# Altium project MiniPC MB GOST.PrjPcb (part 5 of 31)

## Sheet Converter 12V-0V9.SchDoc
size 420 x 297 mm; Author: ALTIUM GOSTBOM2.0 KEV; SheetNumber: 33; SheetTotal: 48
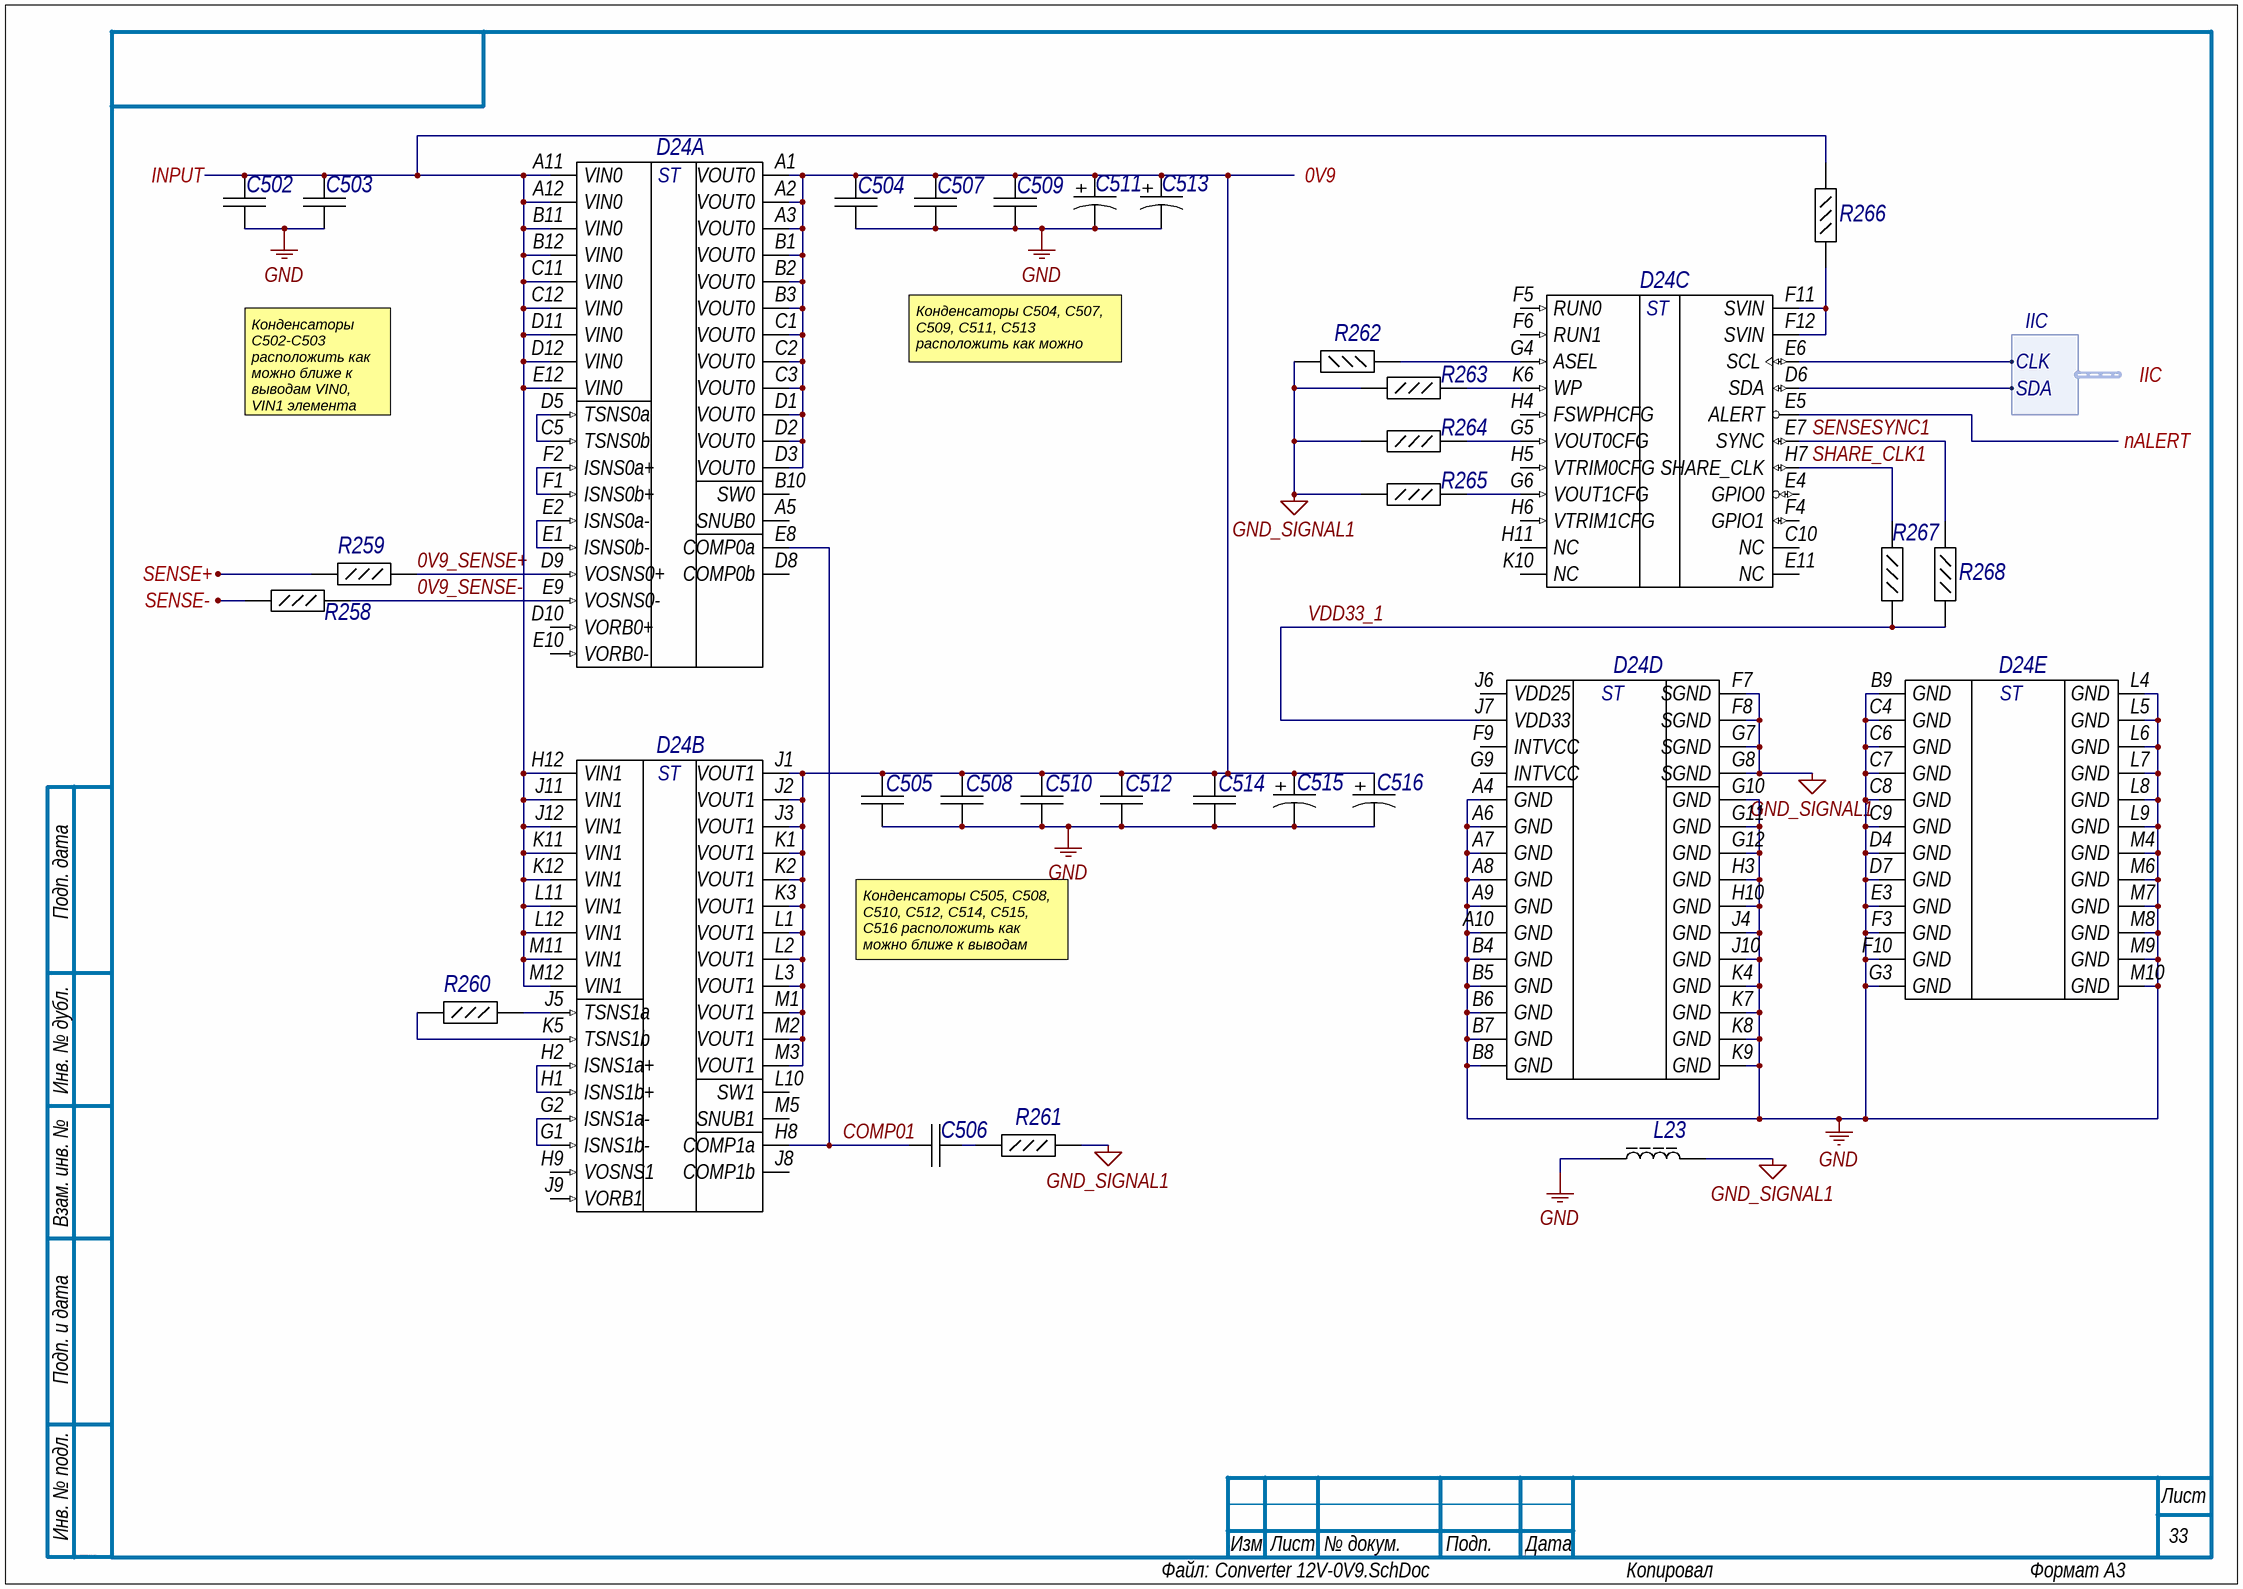
[diagram p7: Converter 12V-0V9.SchDoc]

### Parts
C502  GRM31CR61E226KE15L  [CAPC3216X180X55ML20T25]  (value not drawn)
C503  GRM31CR61E226KE15L  [CAPC3216X180X55ML20T25]  (value not drawn)
C504  GRM31CR60J107ME39L  [CAPC3216X190X55ML30T25]  (value not drawn)
C505  GRM31CR60J107ME39L  [CAPC3216X190X55ML30T25]  (value not drawn)
C506  VJ0402Y182JXJCW1BC  [CAPC1005X55X23NL05T8]  (value not drawn)
C507  GRM31CR60J107ME39L  [CAPC3216X190X55ML30T25]  (value not drawn)
C508  GRM31CR60J107ME39L  [CAPC3216X190X55ML30T25]  (value not drawn)
C509  GRM31CR60J107ME39L  [CAPC3216X190X55ML30T25]  (value not drawn)
C510  GRM31CR60J107ME39L  [CAPC3216X190X55ML30T25]  (value not drawn)
C511  6TPF330M9L  [PNSC-TPF-D3L_V]  (value not drawn)
C512  GRM31CR60J107ME39L  [CAPC3216X190X55ML30T25]  (value not drawn)
C513  6TPF330M9L  [PNSC-TPF-D3L_V]  (value not drawn)
C514  GRM31CR60J107ME39L  [CAPC3216X190X55ML30T25]  (value not drawn)
C515  6TPF330M9L  [PNSC-TPF-D3L_V]  (value not drawn)
C516  6TPF330M9L  [PNSC-TPF-D3L_V]  (value not drawn)
D24  LTM4677IY#PBF  [LT-BGA-144-05-08-1920_V]  (value not drawn)  (parts A,B,C,D,E of 5)
L23  742792609  [SMD-0603]  (value not drawn)
R258  ERJ-2GE0R00X  [RESC1005X40X25LL05T05]  (value not drawn)
R259  ERJ-2GE0R00X  [RESC1005X40X25LL05T05]  (value not drawn)
R260  ERJ-2GE0R00X  [RESC1005X40X25LL05T05]  (value not drawn)
R261  ERJ-2RKF1782X  [RESC1005X40X25LL05T05]  (value not drawn)
R262  ERJ-2RKF1651X  [RESC1005X40X25LL05T05]  (value not drawn)
R263  ERJ-2RKF1002X  [RESC1005X40X25LL05T05]  (value not drawn)
R264  ERJ-2RKF1651X  [RESC1005X40X25LL05T05]  (value not drawn)
R265  ERJ-2RKF1651X  [RESC1005X40X25LL05T05]  (value not drawn)
R266  ERJ-2GE0R00X  [RESC1005X40X25LL05T05]  (value not drawn)
R267  ERJ-2RKF1002X  [RESC1005X40X25LL05T05]  (value not drawn)
R268  ERJ-2RKF1002X  [RESC1005X40X25LL05T05]  (value not drawn)

### Ports
0V9, IIC (harness IIC), INPUT, nALERT, SENSE+, SENSE-

### Harnesses
IIC: CLK, SDA

### Nets
GND: C502.1 C503.1 C504.1 C505.1 C507.1 C508.1 C509.1 C510.1 C511.2 C512.1 C513.2 C514.1 C515.2 C516.2 D24.A4(GND) D24.A6(GND) D24.A7(GND) D24.A8(GND) D24.A9(GND) D24.A10(GND) D24.B4(GND) D24.B5(GND) D24.B6(GND) D24.B7(GND) D24.B8(GND) D24.B9(GND) D24.C4(GND) D24.C6(GND) D24.C7(GND) D24.C8(GND) D24.C9(GND) D24.D4(GND) D24.D7(GND) D24.E3(GND) D24.F3(GND) D24.F10(GND) D24.G3(GND) D24.G10(GND) D24.G11(GND) D24.G12(GND) D24.H3(GND) D24.H10(GND) D24.J4(GND) D24.J10(GND) D24.K4(GND) D24.K7(GND) D24.K8(GND) D24.K9(GND) D24.L4(GND) D24.L5(GND) D24.L6(GND) D24.L7(GND) D24.L8(GND) D24.L9(GND) D24.M4(GND) D24.M6(GND) D24.M7(GND) D24.M8(GND) D24.M9(GND) D24.M10(GND) L23.1
GND_SIGNAL1: D24.F7(SGND) D24.F8(SGND) D24.G7(SGND) D24.G8(SGND) L23.2 R261.1 R262.1 R263.2 R264.2 R265.2
0V9_SENSE+: D24.D9(VOSNS0+) R259.1  [project net 0V9_SENSE+_33]
0V9_SENSE-: D24.E9(VOSNS0-) R258.1  [project net 0V9_SENSE-_33]
12V_OUTPUT: C502.2 C503.2 D24.A11(VIN0) D24.A12(VIN0) D24.B11(VIN0) D24.B12(VIN0) D24.C11(VIN0) D24.C12(VIN0) D24.D11(VIN0) D24.D12(VIN0) D24.E12(VIN0) D24.H12(VIN1) D24.J11(VIN1) D24.J12(VIN1) D24.K11(VIN1) D24.K12(VIN1) D24.L11(VIN1) D24.L12(VIN1) D24.M11(VIN1) D24.M12(VIN1) R266.2 ; port INPUT
COMP01: C506.2 D24.E8(COMP0a) D24.H8(COMP1a)  [project net COMP01_33]
Core_0V9: C504.2 C505.2 C507.2 C508.2 C509.2 C510.2 C511.1 C512.2 C513.1 C514.2 C515.1 C516.1 D24.A1(VOUT0) D24.A2(VOUT0) D24.A3(VOUT0) D24.B1(VOUT0) D24.B2(VOUT0) D24.B3(VOUT0) D24.C1(VOUT0) D24.C2(VOUT0) D24.C3(VOUT0) D24.D1(VOUT0) D24.D2(VOUT0) D24.D3(VOUT0) D24.J1(VOUT1) D24.J2(VOUT1) D24.J3(VOUT1) D24.K1(VOUT1) D24.K2(VOUT1) D24.K3(VOUT1) D24.L1(VOUT1) D24.L2(VOUT1) D24.L3(VOUT1) D24.M1(VOUT1) D24.M2(VOUT1) D24.M3(VOUT1) ; port 0V9
GND_SENSE: R258.2 ; port SENSE-
SENSESYNC1: D24.E7(SYNC) R268.1  [project net SENSESYNC1_33]
SHARE_CLK1: D24.H7(SHARE_CLK) R267.1  [project net SHARE_CLK1_33]
VCC_SENSE: R259.2 ; port SENSE+
VDD33_1: D24.J7(VDD33) R267.2 R268.2  [project net VDD33_1_33]
NetC506_1: C506.1 R261.2
NetD15_D6: D24.D6(SDA) ; port IIC.SDA
NetD15_E5: D24.E5(ALERT) ; port nALERT
NetD15_E6: D24.E6(SCL) ; port IIC.CLK
NetD24_C5: D24.C5(TSNS0b) D24.D5(TSNS0a)
NetD24_E1: D24.E1(ISNS0b-) D24.E2(ISNS0a-)
NetD24_F1: D24.F1(ISNS0b+) D24.F2(ISNS0a+)
NetD24_F11: D24.F11(SVIN) D24.F12(SVIN) R266.1
NetD24_G1: D24.G1(ISNS1b-) D24.G2(ISNS1a-)
NetD24_G4: D24.G4(ASEL) R262.2
NetD24_G5: D24.G5(VOUT0CFG) R264.1
NetD24_G6: D24.G6(VOUT1CFG) R265.1
NetD24_H1: D24.H1(ISNS1b+) D24.H2(ISNS1a+)
NetD24_J5: D24.J5(TSNS1a) R260.1
NetD24_K5: D24.K5(TSNS1b) R260.2
NetD24_K6: D24.K6(WP) R263.1

Not connected (* = marked no-connect by the designer): D24 A5(SNUB0) B10(SW0) C10(NC) D8(COMP0b) D10(VORB0+) E4(GPIO0) E10(VORB0-) E11(NC) F4(GPIO1) F5(RUN0) F6(RUN1) F9(INTVCC) G9(INTVCC) H4(FSWPHCFG) H5(VTRIM0CFG) H6(VTRIM1CFG) H9(VOSNS1) H11(NC) J6(VDD25) J8(COMP1b) J9(VORB1) K10(NC) L10(SW1) M5(SNUB1)

### Notes on the sheet
- Конденсаторы C504, C507, C509, C511, C513 расположить как можно ближе к выводам VOUT0 элемента D24.
- Конденсаторы C502-C503 расположить как можно ближе к выводам VIN0, VIN1 элемента D24.
- Конденсаторы C505, C508, C510, C512, C514, C515, C516 расположить как можно ближе к выводам VOUT1 элемента D24.
- Подп. дата
- Инв. № дубл.
- Взам. инв. №
- Подп. и дата
- Инв. № подл.
- Изм.
- Лист
- № докум.
- Подп.
- Дата
- ALTIUM GOSTBOM2.0 KEV
- Файл:
- Копировал
- Формат А3
- (in symbol E13) +
- (in symbol E110, part A) ST
- (in symbol E110, part B) ST
- (in symbol E110, part C) ST
- (in symbol E110, part D) ST
- (in symbol E110, part E) ST

### Library data of the parts
C502 = E5: Chip Capacitor, 22 uF, +/- 10%, 25 V, -55 to 85 degC, 1206 (3216 Metric), RoHS, Tape and Reel; Тип элемента: Конденсатор; Capacitance: 22 uF; Case\/Package: 1206; Type (Capacitors): X5R; Voltage Rating: 25 V; Old_des: C85; New_des: C502; UID: E5; Component Kind: Standard; Case Code (Imperial): 1206; Case Code (Metric): 3216; ComponentLink1Description: Manufacturer URL; ComponentLink1URL: http://www.murata.com/; ComponentLink2Description: Datasheet; ComponentLink2URL: http://search.murata.co.jp/Ceramy/image/img/A01X/G101/ENG/GRM31CR61E226KE15-01.pdf; DatasheetVersion: 03/2016; Length: 3.2 mm; Max Operating Temperature: 85 degC; Min Operating Temperature: -55 degC; Mounting Technology: Surface Mount; Package Quantity: 2000; PackageDescription: 2-Pin Surface Mount Device, Body 3.2 x 1.6 mm; Packaging: Tape and Reel; PartNumber: GRM31CR61E226KE15L; RoHSCompliant: true; Tolerance: 10%; Width: 1.6 mm; Height: 1.6 mm; Mount: Surface Mount; PackageReference: 1206; Pins: 2; Radiation Hardening: No; REACH SVHC: No SVHC; Voltage Rating (DC): 25 V
C503 = E5: Chip Capacitor, 22 uF, +/- 10%, 25 V, -55 to 85 degC, 1206 (3216 Metric), RoHS, Tape and Reel; Тип элемента: Конденсатор; Capacitance: 22 uF; Case\/Package: 1206; Type (Capacitors): X5R; Voltage Rating: 25 V; Old_des: C86; New_des: C503; UID: E5; Component Kind: Standard; Case Code (Imperial): 1206; Case Code (Metric): 3216; ComponentLink1Description: Manufacturer URL; ComponentLink1URL: http://www.murata.com/; ComponentLink2Description: Datasheet; ComponentLink2URL: http://search.murata.co.jp/Ceramy/image/img/A01X/G101/ENG/GRM31CR61E226KE15-01.pdf; DatasheetVersion: 03/2016; Length: 3.2 mm; Max Operating Temperature: 85 degC; Min Operating Temperature: -55 degC; Mounting Technology: Surface Mount; Package Quantity: 2000; PackageDescription: 2-Pin Surface Mount Device, Body 3.2 x 1.6 mm; Packaging: Tape and Reel; PartNumber: GRM31CR61E226KE15L; RoHSCompliant: true; Tolerance: 10%; Width: 1.6 mm; Height: 1.6 mm; Mount: Surface Mount; PackageReference: 1206; Pins: 2; Radiation Hardening: No; REACH SVHC: No SVHC; Voltage Rating (DC): 25 V
C504 = E14: Chip Capacitor, 100 uF, +/- 20%, 6.3 V, -55 to 85 degC, 1206 (3216 Metric), RoHS, Tape and Reel; Тип элемента: Конденсатор; Capacitance: 100 uF; Case\/Package: 1206; Type (Capacitors): X5R; Voltage Rating: 6.3 V; Old_des: C82; New_des: C504; UID: E14; Component Kind: Standard; Case Code (Imperial): 1206; Case Code (Metric): 3216; ComponentLink1Description: Manufacturer URL; ComponentLink1URL: http://www.murata.com/; ComponentLink2Description: Datasheet; ComponentLink2URL: http://psearch.en.murata.com/capacitor/product/GRM31CR60J107ME39%23.pdf; DatasheetVersion: 09/2016; Length: 3.2 mm; Max Operating Temperature: 85 degC; Min Operating Temperature: -55 degC; Mounting Technology: Surface Mount; Package Quantity: 2000; PackageDescription: 2-Pin Surface Mount Device, Body 3.2 x 1.6 mm; Packaging: Tape and Reel; PartNumber: GRM31CR60J107ME39L; RoHSCompliant: true; Tolerance: 20%; Width: 1.6 mm; Height: 1.6 mm; Mount: Surface Mount; PackageReference: 1206; Pins: 2; Radiation Hardening: No; REACH SVHC: No SVHC; Voltage Rating (DC): 6.3 V
C505 = E14: Chip Capacitor, 100 uF, +/- 20%, 6.3 V, -55 to 85 degC, 1206 (3216 Metric), RoHS, Tape and Reel; Тип элемента: Конденсатор; Capacitance: 100 uF; Case\/Package: 1206; Type (Capacitors): X5R; Voltage Rating: 6.3 V; Old_des: C89; New_des: C505; UID: E14; Component Kind: Standard; Case Code (Imperial): 1206; Case Code (Metric): 3216; ComponentLink1Description: Manufacturer URL; ComponentLink1URL: http://www.murata.com/; ComponentLink2Description: Datasheet; ComponentLink2URL: http://psearch.en.murata.com/capacitor/product/GRM31CR60J107ME39%23.pdf; DatasheetVersion: 09/2016; Length: 3.2 mm; Max Operating Temperature: 85 degC; Min Operating Temperature: -55 degC; Mounting Technology: Surface Mount; Package Quantity: 2000; PackageDescription: 2-Pin Surface Mount Device, Body 3.2 x 1.6 mm; Packaging: Tape and Reel; PartNumber: GRM31CR60J107ME39L; RoHSCompliant: true; Tolerance: 20%; Width: 1.6 mm; Height: 1.6 mm; Mount: Surface Mount; PackageReference: 1206; Pins: 2; Radiation Hardening: No; REACH SVHC: No SVHC; Voltage Rating (DC): 6.3 V
C506 = E15: Chip Capacitor, 1.8 nF, +/- 5%, 16 V, -55 to 125 degC, 0402 (1005 Metric), RoHS, Tape and Reel; Тип элемента: Конденсатор; Capacitance: 1800 pF; Case\/Package: 0402; Type (Capacitors): X7R; Voltage Rating: 16 V; Old_des: C94; New_des: C506; UID: E15; Component Kind: Standard; Case Code (Imperial): 0402; Case Code (Metric): 1005; ComponentLink1Description: Manufacturer URL; ComponentLink1URL: http://www.vishay.com/; ComponentLink2Description: Datasheet; ComponentLink2URL: http://www.vishay.com/docs/28548/vjw1bcbascomseries.pdf; DatasheetVersion: 07/2016; Length: 1 mm; Max Operating Temperature: 125 degC; Min Operating Temperature: -55 degC; Mounting Technology: Surface Mount; Package Quantity: 10000; PackageDescription: 2-Pin Surface Mount Device, Body 1 x 0.5 mm; Packaging: Tape and Reel; PartNumber: VJ0402Y182JXJCW1BC; RoHSCompliant: true; Tolerance: 5%; Width: 0.5 mm; Height: 0.5 mm; Mount: Surface Mount; PackageReference: 0402; Pins: 2; Voltage Rating (DC): 16 V
C507 = E14: Chip Capacitor, 100 uF, +/- 20%, 6.3 V, -55 to 85 degC, 1206 (3216 Metric), RoHS, Tape and Reel; Тип элемента: Конденсатор; Capacitance: 100 uF; Case\/Package: 1206; Type (Capacitors): X5R; Voltage Rating: 6.3 V; Old_des: C83; New_des: C507; UID: E14; Component Kind: Standard; Case Code (Imperial): 1206; Case Code (Metric): 3216; ComponentLink1Description: Manufacturer URL; ComponentLink1URL: http://www.murata.com/; ComponentLink2Description: Datasheet; ComponentLink2URL: http://psearch.en.murata.com/capacitor/product/GRM31CR60J107ME39%23.pdf; DatasheetVersion: 09/2016; Length: 3.2 mm; Max Operating Temperature: 85 degC; Min Operating Temperature: -55 degC; Mounting Technology: Surface Mount; Package Quantity: 2000; PackageDescription: 2-Pin Surface Mount Device, Body 3.2 x 1.6 mm; Packaging: Tape and Reel; PartNumber: GRM31CR60J107ME39L; RoHSCompliant: true; Tolerance: 20%; Width: 1.6 mm; Height: 1.6 mm; Mount: Surface Mount; PackageReference: 1206; Pins: 2; Radiation Hardening: No; REACH SVHC: No SVHC; Voltage Rating (DC): 6.3 V
C508 = E14: Chip Capacitor, 100 uF, +/- 20%, 6.3 V, -55 to 85 degC, 1206 (3216 Metric), RoHS, Tape and Reel; Тип элемента: Конденсатор; Capacitance: 100 uF; Case\/Package: 1206; Type (Capacitors): X5R; Voltage Rating: 6.3 V; Old_des: C90; New_des: C508; UID: E14; Component Kind: Standard; Case Code (Imperial): 1206; Case Code (Metric): 3216; ComponentLink1Description: Manufacturer URL; ComponentLink1URL: http://www.murata.com/; ComponentLink2Description: Datasheet; ComponentLink2URL: http://psearch.en.murata.com/capacitor/product/GRM31CR60J107ME39%23.pdf; DatasheetVersion: 09/2016; Length: 3.2 mm; Max Operating Temperature: 85 degC; Min Operating Temperature: -55 degC; Mounting Technology: Surface Mount; Package Quantity: 2000; PackageDescription: 2-Pin Surface Mount Device, Body 3.2 x 1.6 mm; Packaging: Tape and Reel; PartNumber: GRM31CR60J107ME39L; RoHSCompliant: true; Tolerance: 20%; Width: 1.6 mm; Height: 1.6 mm; Mount: Surface Mount; PackageReference: 1206; Pins: 2; Radiation Hardening: No; REACH SVHC: No SVHC; Voltage Rating (DC): 6.3 V
C509 = E14: Chip Capacitor, 100 uF, +/- 20%, 6.3 V, -55 to 85 degC, 1206 (3216 Metric), RoHS, Tape and Reel; Тип элемента: Конденсатор; Capacitance: 100 uF; Case\/Package: 1206; Type (Capacitors): X5R; Voltage Rating: 6.3 V; Old_des: C84; New_des: C509; UID: E14; Component Kind: Standard; Case Code (Imperial): 1206; Case Code (Metric): 3216; ComponentLink1Description: Manufacturer URL; ComponentLink1URL: http://www.murata.com/; ComponentLink2Description: Datasheet; ComponentLink2URL: http://psearch.en.murata.com/capacitor/product/GRM31CR60J107ME39%23.pdf; DatasheetVersion: 09/2016; Length: 3.2 mm; Max Operating Temperature: 85 degC; Min Operating Temperature: -55 degC; Mounting Technology: Surface Mount; Package Quantity: 2000; PackageDescription: 2-Pin Surface Mount Device, Body 3.2 x 1.6 mm; Packaging: Tape and Reel; PartNumber: GRM31CR60J107ME39L; RoHSCompliant: true; Tolerance: 20%; Width: 1.6 mm; Height: 1.6 mm; Mount: Surface Mount; PackageReference: 1206; Pins: 2; Radiation Hardening: No; REACH SVHC: No SVHC; Voltage Rating (DC): 6.3 V
C510 = E14: Chip Capacitor, 100 uF, +/- 20%, 6.3 V, -55 to 85 degC, 1206 (3216 Metric), RoHS, Tape and Reel; Тип элемента: Конденсатор; Capacitance: 100 uF; Case\/Package: 1206; Type (Capacitors): X5R; Voltage Rating: 6.3 V; Old_des: C91; New_des: C510; UID: E14; Component Kind: Standard; Case Code (Imperial): 1206; Case Code (Metric): 3216; ComponentLink1Description: Manufacturer URL; ComponentLink1URL: http://www.murata.com/; ComponentLink2Description: Datasheet; ComponentLink2URL: http://psearch.en.murata.com/capacitor/product/GRM31CR60J107ME39%23.pdf; DatasheetVersion: 09/2016; Length: 3.2 mm; Max Operating Temperature: 85 degC; Min Operating Temperature: -55 degC; Mounting Technology: Surface Mount; Package Quantity: 2000; PackageDescription: 2-Pin Surface Mount Device, Body 3.2 x 1.6 mm; Packaging: Tape and Reel; PartNumber: GRM31CR60J107ME39L; RoHSCompliant: true; Tolerance: 20%; Width: 1.6 mm; Height: 1.6 mm; Mount: Surface Mount; PackageReference: 1206; Pins: 2; Radiation Hardening: No; REACH SVHC: No SVHC; Voltage Rating (DC): 6.3 V
C511 = E13: Tantalum Capacitor, 330 uF, +/- 20%, 6.3 V, -55 to 105 degC, 2-Pin Molded, RoHS, Tape and Reel; Тип элемента: Конденсатор; Capacitance: 330 uF; Old_des: C80; New_des: C511; UID: E13; Component Kind: Standard; Case/Package: 2917; ComponentLink1Description: Manufacturer URL; ComponentLink1URL: http://www.panasonic.com/; ComponentLink2Description: Datasheet; ComponentLink2URL: http://industrial.panasonic.com/cdbs/www-data/pdf/AAA8000/AAA8000C38.pdf; DatasheetVersion: 11/2015; Length: 0.287 inch; Max Operating Temperature: 105 degC; Min Operating Temperature: -55 degC; Mounting Technology: Surface Mount; Package Quantity: 2500; PackageDescription: 2-Pin Molded Capacitor, Body 7.3 x 4.3 mm; Packaging: Tape and Reel; PartNumber: 6TPF330M9L; RoHSCompliant: True; Width: 0.169 inch; Height: 2.8 mm; Mount: Surface Mount; Radiation Hardening: No; REACH SVHC: Unknown; ComponentLink3Description: Package Specification; ComponentLink3URL: http://industrial.panasonic.com/cdbs/www-data/pdf/AAA8000/AAA8000COL34.pdf
C512 = E14: Chip Capacitor, 100 uF, +/- 20%, 6.3 V, -55 to 85 degC, 1206 (3216 Metric), RoHS, Tape and Reel; Тип элемента: Конденсатор; Capacitance: 100 uF; Case\/Package: 1206; Type (Capacitors): X5R; Voltage Rating: 6.3 V; Old_des: C92; New_des: C512; UID: E14; Component Kind: Standard; Case Code (Imperial): 1206; Case Code (Metric): 3216; ComponentLink1Description: Manufacturer URL; ComponentLink1URL: http://www.murata.com/; ComponentLink2Description: Datasheet; ComponentLink2URL: http://psearch.en.murata.com/capacitor/product/GRM31CR60J107ME39%23.pdf; DatasheetVersion: 09/2016; Length: 3.2 mm; Max Operating Temperature: 85 degC; Min Operating Temperature: -55 degC; Mounting Technology: Surface Mount; Package Quantity: 2000; PackageDescription: 2-Pin Surface Mount Device, Body 3.2 x 1.6 mm; Packaging: Tape and Reel; PartNumber: GRM31CR60J107ME39L; RoHSCompliant: true; Tolerance: 20%; Width: 1.6 mm; Height: 1.6 mm; Mount: Surface Mount; PackageReference: 1206; Pins: 2; Radiation Hardening: No; REACH SVHC: No SVHC; Voltage Rating (DC): 6.3 V
C513 = E13: Tantalum Capacitor, 330 uF, +/- 20%, 6.3 V, -55 to 105 degC, 2-Pin Molded, RoHS, Tape and Reel; Тип элемента: Конденсатор; Capacitance: 330 uF; Old_des: C81; New_des: C513; UID: E13; Component Kind: Standard; Case/Package: 2917; ComponentLink1Description: Manufacturer URL; ComponentLink1URL: http://www.panasonic.com/; ComponentLink2Description: Datasheet; ComponentLink2URL: http://industrial.panasonic.com/cdbs/www-data/pdf/AAA8000/AAA8000C38.pdf; DatasheetVersion: 11/2015; Length: 0.287 inch; Max Operating Temperature: 105 degC; Min Operating Temperature: -55 degC; Mounting Technology: Surface Mount; Package Quantity: 2500; PackageDescription: 2-Pin Molded Capacitor, Body 7.3 x 4.3 mm; Packaging: Tape and Reel; PartNumber: 6TPF330M9L; RoHSCompliant: True; Width: 0.169 inch; Height: 2.8 mm; Mount: Surface Mount; Radiation Hardening: No; REACH SVHC: Unknown; ComponentLink3Description: Package Specification; ComponentLink3URL: http://industrial.panasonic.com/cdbs/www-data/pdf/AAA8000/AAA8000COL34.pdf
C514 = E14: Chip Capacitor, 100 uF, +/- 20%, 6.3 V, -55 to 85 degC, 1206 (3216 Metric), RoHS, Tape and Reel; Тип элемента: Конденсатор; Capacitance: 100 uF; Case\/Package: 1206; Type (Capacitors): X5R; Voltage Rating: 6.3 V; Old_des: C93; New_des: C514; UID: E14; Component Kind: Standard; Case Code (Imperial): 1206; Case Code (Metric): 3216; ComponentLink1Description: Manufacturer URL; ComponentLink1URL: http://www.murata.com/; ComponentLink2Description: Datasheet; ComponentLink2URL: http://psearch.en.murata.com/capacitor/product/GRM31CR60J107ME39%23.pdf; DatasheetVersion: 09/2016; Length: 3.2 mm; Max Operating Temperature: 85 degC; Min Operating Temperature: -55 degC; Mounting Technology: Surface Mount; Package Quantity: 2000; PackageDescription: 2-Pin Surface Mount Device, Body 3.2 x 1.6 mm; Packaging: Tape and Reel; PartNumber: GRM31CR60J107ME39L; RoHSCompliant: true; Tolerance: 20%; Width: 1.6 mm; Height: 1.6 mm; Mount: Surface Mount; PackageReference: 1206; Pins: 2; Radiation Hardening: No; REACH SVHC: No SVHC; Voltage Rating (DC): 6.3 V
C515 = E13: Tantalum Capacitor, 330 uF, +/- 20%, 6.3 V, -55 to 105 degC, 2-Pin Molded, RoHS, Tape and Reel; Тип элемента: Конденсатор; Capacitance: 330 uF; Old_des: C87; New_des: C515; UID: E13; Component Kind: Standard; Case/Package: 2917; ComponentLink1Description: Manufacturer URL; ComponentLink1URL: http://www.panasonic.com/; ComponentLink2Description: Datasheet; ComponentLink2URL: http://industrial.panasonic.com/cdbs/www-data/pdf/AAA8000/AAA8000C38.pdf; DatasheetVersion: 11/2015; Length: 0.287 inch; Max Operating Temperature: 105 degC; Min Operating Temperature: -55 degC; Mounting Technology: Surface Mount; Package Quantity: 2500; PackageDescription: 2-Pin Molded Capacitor, Body 7.3 x 4.3 mm; Packaging: Tape and Reel; PartNumber: 6TPF330M9L; RoHSCompliant: True; Width: 0.169 inch; Height: 2.8 mm; Mount: Surface Mount; Radiation Hardening: No; REACH SVHC: Unknown; ComponentLink3Description: Package Specification; ComponentLink3URL: http://industrial.panasonic.com/cdbs/www-data/pdf/AAA8000/AAA8000COL34.pdf
C516 = E13: Tantalum Capacitor, 330 uF, +/- 20%, 6.3 V, -55 to 105 degC, 2-Pin Molded, RoHS, Tape and Reel; Тип элемента: Конденсатор; Capacitance: 330 uF; Old_des: C88; New_des: C516; UID: E13; Component Kind: Standard; Case/Package: 2917; ComponentLink1Description: Manufacturer URL; ComponentLink1URL: http://www.panasonic.com/; ComponentLink2Description: Datasheet; ComponentLink2URL: http://industrial.panasonic.com/cdbs/www-data/pdf/AAA8000/AAA8000C38.pdf; DatasheetVersion: 11/2015; Length: 0.287 inch; Max Operating Temperature: 105 degC; Min Operating Temperature: -55 degC; Mounting Technology: Surface Mount; Package Quantity: 2500; PackageDescription: 2-Pin Molded Capacitor, Body 7.3 x 4.3 mm; Packaging: Tape and Reel; PartNumber: 6TPF330M9L; RoHSCompliant: True; Width: 0.169 inch; Height: 2.8 mm; Mount: Surface Mount; Radiation Hardening: No; REACH SVHC: Unknown; ComponentLink3Description: Package Specification; ComponentLink3URL: http://industrial.panasonic.com/cdbs/www-data/pdf/AAA8000/AAA8000COL34.pdf
D24 = E110: Dual 18 A or Single 36 A uModule Regulator with Digital Power System Management, 4.5 to 16 V Input, 0.5 to 1.8 V Output, -40 to 125 degC, 144-Ball BGA, RoHS, Tray; Manufacturer: Linear Technology; Тип элемента: Стабилизатор; Old_des: U10; New_des: D24; UID: E110; Component Kind: Standard; ComponentLink1Description: Manufacturer URL; ComponentLink1URL: http://www.linear.com/; ComponentLink2Description: Datasheet; ComponentLink2URL: http://cds.linear.com/docs/en/datasheet/4677f.pdf; DatasheetVersion: Rev. F; Mounting Technology: Surface Mount; PackageDescription: 144-Ball Ball Grid Array, Body 16 x 16 mm, Pitch 1.27 mm; PartNumber: LTM4677IY#PBF; PackageReference: BGA-144; ComponentLink3Description: Package Specification; ComponentLink3URL: http://www.linear.com/docs/41077; PackageVersion: Rev. B, 02/2013
L23 = E45: SMD EMI Suppression Ferrite Bead WE-CBF, Z = 30 Ohm; Тип элемента: Ферритовый дроссель; Impedance: 30 Ohm; Old_des: L8; New_des: L23; UID: E45; Component Kind: Standard; ComponentLink1Description: Manufacturer Link; ComponentLink1URL: http://www.we-online.com; ComponentLink2Description: Datasheet; ComponentLink2URL: http://www.we-online.de/katalog/media/pdf/742792609.pdf; DatasheetVersion: Dec-2005; PackageDescription: Chip Inductor, 2-Leads, Body 1.6 x 0.8 mm; PackageReference: SMD-0603; PackageVersion: 2009
R258 = E64: Chip Resistor, 0 mOhm, +/- 5%, 100 mW, -55 to 155 degC, 0402 (1005 Metric), RoHS, Tape and Reel; Manufacturer: Basic Passives; Тип элемента: Резистор; Case\/Package: 0402; Voltage Rating: 50 V; Power Rating: 100 mW; Resistance: 0 mOhm; Old_des: R143; New_des: R258; UID: E64; Component Kind: Standard; Case Code (Imperial): 0402; Case Code (Metric): 1005; ComponentLink1Description: Manufacturer URL; ComponentLink1URL: http://www.panasonic.com/; ComponentLink2Description: Datasheet; ComponentLink2URL: http://industrial.panasonic.com/cdbs/www-data/pdf/RDA0000/AOA0000C84.pdf; DatasheetVersion: 03/2015; Length: 1 mm; Max Operating Temperature: 155 degC; Min Operating Temperature: -55 degC; Mounting Technology: Surface Mount; Package Quantity: 10000; PackageDescription: 2-Pin Surface Mount Device, Body 1 x 0.5 mm; Packaging: Tape and Reel; PartNumber: ERJ-2GE0R00X; RoHSCompliant: true; Tolerance: 5%; Width: 0.5 mm; Height: 0.35 mm; Mount: Surface Mount; PackageReference: 0402; Pins: 2; Radiation Hardening: No; REACH SVHC: Unknown
R259 = E64: Chip Resistor, 0 mOhm, +/- 5%, 100 mW, -55 to 155 degC, 0402 (1005 Metric), RoHS, Tape and Reel; Manufacturer: Basic Passives; Тип элемента: Резистор; Case\/Package: 0402; Voltage Rating: 50 V; Power Rating: 100 mW; Resistance: 0 mOhm; Old_des: R142; New_des: R259; UID: E64; Component Kind: Standard; Case Code (Imperial): 0402; Case Code (Metric): 1005; ComponentLink1Description: Manufacturer URL; ComponentLink1URL: http://www.panasonic.com/; ComponentLink2Description: Datasheet; ComponentLink2URL: http://industrial.panasonic.com/cdbs/www-data/pdf/RDA0000/AOA0000C84.pdf; DatasheetVersion: 03/2015; Length: 1 mm; Max Operating Temperature: 155 degC; Min Operating Temperature: -55 degC; Mounting Technology: Surface Mount; Package Quantity: 10000; PackageDescription: 2-Pin Surface Mount Device, Body 1 x 0.5 mm; Packaging: Tape and Reel; PartNumber: ERJ-2GE0R00X; RoHSCompliant: true; Tolerance: 5%; Width: 0.5 mm; Height: 0.35 mm; Mount: Surface Mount; PackageReference: 0402; Pins: 2; Radiation Hardening: No; REACH SVHC: Unknown
R260 = E64: Chip Resistor, 0 mOhm, +/- 5%, 100 mW, -55 to 155 degC, 0402 (1005 Metric), RoHS, Tape and Reel; Manufacturer: Basic Passives; Тип элемента: Резистор; Case\/Package: 0402; Voltage Rating: 50 V; Power Rating: 100 mW; Resistance: 0 mOhm; Old_des: R149; New_des: R260; UID: E64; Component Kind: Standard; Case Code (Imperial): 0402; Case Code (Metric): 1005; ComponentLink1Description: Manufacturer URL; ComponentLink1URL: http://www.panasonic.com/; ComponentLink2Description: Datasheet; ComponentLink2URL: http://industrial.panasonic.com/cdbs/www-data/pdf/RDA0000/AOA0000C84.pdf; DatasheetVersion: 03/2015; Length: 1 mm; Max Operating Temperature: 155 degC; Min Operating Temperature: -55 degC; Mounting Technology: Surface Mount; Package Quantity: 10000; PackageDescription: 2-Pin Surface Mount Device, Body 1 x 0.5 mm; Packaging: Tape and Reel; PartNumber: ERJ-2GE0R00X; RoHSCompliant: true; Tolerance: 5%; Width: 0.5 mm; Height: 0.35 mm; Mount: Surface Mount; PackageReference: 0402; Pins: 2; Radiation Hardening: No; REACH SVHC: Unknown
R261 = E86: Chip Resistor, 17.8 KOhm, +/- 1%, 100 mW, -55 to 155 degC, 0402 (1005 Metric), RoHS, Tape and Reel; Manufacturer: Basic Passives; Тип элемента: Резистор; Case\/Package: 0402; Voltage Rating: 50 V; Power Rating: 100 mW; Old_des: R152; New_des: R261; UID: E86; Component Kind: Standard; Case Code (Imperial): 0402; Case Code (Metric): 1005; ComponentLink1Description: Manufacturer URL; ComponentLink1URL: http://www.panasonic.com/; ComponentLink2Description: Datasheet; ComponentLink2URL: http://industrial.panasonic.com/cdbs/www-data/pdf/RDA0000/AOA0000C86.pdf; DatasheetVersion: 04/2015; Length: 1 mm; Max Operating Temperature: 155 degC; Min Operating Temperature: -55 degC; Mounting Technology: Surface Mount; Package Quantity: 10000; PackageDescription: 2-Pin Surface Mount Device, Body 1 x 0.5 mm; Packaging: Tape and Reel; PartNumber: ERJ-2RKF1782X; RoHSCompliant: true; Tolerance: 1%; Width: 0.5 mm; Height: 0.35 mm; Mount: Surface Mount; PackageReference: 0402; Pins: 2; REACH SVHC: Unknown; Resistance: 17.8 KOhm
R262 = E85: Chip Resistor, 1.65 KOhm, +/- 1%, 100 mW, -55 to 155 degC, 0402 (1005 Metric), RoHS, Tape and Reel; Manufacturer: Basic Passives; Тип элемента: Резистор; Case\/Package: 0402; Voltage Rating: 50 V; Power Rating: 100 mW; Old_des: R150; New_des: R262; UID: E85; Component Kind: Standard; Case Code (Imperial): 0402; Case Code (Metric): 1005; ComponentLink1Description: Manufacturer URL; ComponentLink1URL: http://www.panasonic.com/; ComponentLink2Description: Datasheet; ComponentLink2URL: http://industrial.panasonic.com/cdbs/www-data/pdf/RDA0000/AOA0000C86.pdf; DatasheetVersion: 04/2015; Length: 1 mm; Max Operating Temperature: 155 degC; Min Operating Temperature: -55 degC; Mounting Technology: Surface Mount; Package Quantity: 10000; PackageDescription: 2-Pin Surface Mount Device, Body 1 x 0.5 mm; Packaging: Tape and Reel; PartNumber: ERJ-2RKF1651X; RoHSCompliant: true; Tolerance: 1%; Width: 0.5 mm; Height: 0.35 mm; Mount: Surface Mount; PackageReference: 0402; Pins: 2; REACH SVHC: Yes; Resistance: 1.65 KOhm
R263 = E60: Chip Resistor, 10 KOhm, +/- 1%, 100 mW, -55 to 155 degC, 0402 (1005 Metric), RoHS, Tape and Reel; Manufacturer: Basic Passives; Тип элемента: Резистор; Case\/Package: 0402; Voltage Rating: 50 V; Power Rating: 100 mW; Resistance: 10 KOhm; Old_des: R151; New_des: R265; UID: E60; Component Kind: Standard; Case Code (Imperial): 0402; Case Code (Metric): 1005; ComponentLink1Description: Manufacturer URL; ComponentLink1URL: http://www.panasonic.com/; ComponentLink2Description: Datasheet; ComponentLink2URL: http://industrial.panasonic.com/cdbs/www-data/pdf/RDA0000/AOA0000C86.pdf; DatasheetVersion: 04/2015; Length: 1 mm; Max Operating Temperature: 155 degC; Min Operating Temperature: -55 degC; Mounting Technology: Surface Mount; Package Quantity: 10000; PackageDescription: 2-Pin Surface Mount Device, Body 1 x 0.5 mm; Packaging: Tape and Reel; PartNumber: ERJ-2RKF1002X; RoHSCompliant: true; Tolerance: 1%; Width: 0.5 mm; Height: 0.35 mm; Mount: Surface Mount; PackageReference: 0402; Pins: 2; Radiation Hardening: No; REACH SVHC: Yes
R264 = E85: Chip Resistor, 1.65 KOhm, +/- 1%, 100 mW, -55 to 155 degC, 0402 (1005 Metric), RoHS, Tape and Reel; Manufacturer: Basic Passives; Тип элемента: Резистор; Case\/Package: 0402; Voltage Rating: 50 V; Power Rating: 100 mW; Old_des: R153; New_des: R263; UID: E85; Component Kind: Standard; Case Code (Imperial): 0402; Case Code (Metric): 1005; ComponentLink1Description: Manufacturer URL; ComponentLink1URL: http://www.panasonic.com/; ComponentLink2Description: Datasheet; ComponentLink2URL: http://industrial.panasonic.com/cdbs/www-data/pdf/RDA0000/AOA0000C86.pdf; DatasheetVersion: 04/2015; Length: 1 mm; Max Operating Temperature: 155 degC; Min Operating Temperature: -55 degC; Mounting Technology: Surface Mount; Package Quantity: 10000; PackageDescription: 2-Pin Surface Mount Device, Body 1 x 0.5 mm; Packaging: Tape and Reel; PartNumber: ERJ-2RKF1651X; RoHSCompliant: true; Tolerance: 1%; Width: 0.5 mm; Height: 0.35 mm; Mount: Surface Mount; PackageReference: 0402; Pins: 2; REACH SVHC: Yes; Resistance: 1.65 KOhm
R265 = E85: Chip Resistor, 1.65 KOhm, +/- 1%, 100 mW, -55 to 155 degC, 0402 (1005 Metric), RoHS, Tape and Reel; Manufacturer: Basic Passives; Тип элемента: Резистор; Case\/Package: 0402; Voltage Rating: 50 V; Power Rating: 100 mW; Old_des: R154; New_des: R264; UID: E85; Component Kind: Standard; Case Code (Imperial): 0402; Case Code (Metric): 1005; ComponentLink1Description: Manufacturer URL; ComponentLink1URL: http://www.panasonic.com/; ComponentLink2Description: Datasheet; ComponentLink2URL: http://industrial.panasonic.com/cdbs/www-data/pdf/RDA0000/AOA0000C86.pdf; DatasheetVersion: 04/2015; Length: 1 mm; Max Operating Temperature: 155 degC; Min Operating Temperature: -55 degC; Mounting Technology: Surface Mount; Package Quantity: 10000; PackageDescription: 2-Pin Surface Mount Device, Body 1 x 0.5 mm; Packaging: Tape and Reel; PartNumber: ERJ-2RKF1651X; RoHSCompliant: true; Tolerance: 1%; Width: 0.5 mm; Height: 0.35 mm; Mount: Surface Mount; PackageReference: 0402; Pins: 2; REACH SVHC: Yes; Resistance: 1.65 KOhm
R266 = E64: Chip Resistor, 0 mOhm, +/- 5%, 100 mW, -55 to 155 degC, 0402 (1005 Metric), RoHS, Tape and Reel; Manufacturer: Basic Passives; Тип элемента: Резистор; Case\/Package: 0402; Voltage Rating: 50 V; Power Rating: 100 mW; Resistance: 0 mOhm; Old_des: R141; New_des: R266; UID: E64; Component Kind: Standard; Case Code (Imperial): 0402; Case Code (Metric): 1005; ComponentLink1Description: Manufacturer URL; ComponentLink1URL: http://www.panasonic.com/; ComponentLink2Description: Datasheet; ComponentLink2URL: http://industrial.panasonic.com/cdbs/www-data/pdf/RDA0000/AOA0000C84.pdf; DatasheetVersion: 03/2015; Length: 1 mm; Max Operating Temperature: 155 degC; Min Operating Temperature: -55 degC; Mounting Technology: Surface Mount; Package Quantity: 10000; PackageDescription: 2-Pin Surface Mount Device, Body 1 x 0.5 mm; Packaging: Tape and Reel; PartNumber: ERJ-2GE0R00X; RoHSCompliant: true; Tolerance: 5%; Width: 0.5 mm; Height: 0.35 mm; Mount: Surface Mount; PackageReference: 0402; Pins: 2; Radiation Hardening: No; REACH SVHC: Unknown
R267 = E60: Chip Resistor, 10 KOhm, +/- 1%, 100 mW, -55 to 155 degC, 0402 (1005 Metric), RoHS, Tape and Reel; Manufacturer: Basic Passives; Тип элемента: Резистор; Case\/Package: 0402; Voltage Rating: 50 V; Power Rating: 100 mW; Resistance: 10 KOhm; Old_des: R148; New_des: R267; UID: E60; Component Kind: Standard; Case Code (Imperial): 0402; Case Code (Metric): 1005; ComponentLink1Description: Manufacturer URL; ComponentLink1URL: http://www.panasonic.com/; ComponentLink2Description: Datasheet; ComponentLink2URL: http://industrial.panasonic.com/cdbs/www-data/pdf/RDA0000/AOA0000C86.pdf; DatasheetVersion: 04/2015; Length: 1 mm; Max Operating Temperature: 155 degC; Min Operating Temperature: -55 degC; Mounting Technology: Surface Mount; Package Quantity: 10000; PackageDescription: 2-Pin Surface Mount Device, Body 1 x 0.5 mm; Packaging: Tape and Reel; PartNumber: ERJ-2RKF1002X; RoHSCompliant: true; Tolerance: 1%; Width: 0.5 mm; Height: 0.35 mm; Mount: Surface Mount; PackageReference: 0402; Pins: 2; Radiation Hardening: No; REACH SVHC: Yes
R268 = E60: Chip Resistor, 10 KOhm, +/- 1%, 100 mW, -55 to 155 degC, 0402 (1005 Metric), RoHS, Tape and Reel; Manufacturer: Basic Passives; Тип элемента: Резистор; Case\/Package: 0402; Voltage Rating: 50 V; Power Rating: 100 mW; Resistance: 10 KOhm; Old_des: R147; New_des: R268; UID: E60; Component Kind: Standard; Case Code (Imperial): 0402; Case Code (Metric): 1005; ComponentLink1Description: Manufacturer URL; ComponentLink1URL: http://www.panasonic.com/; ComponentLink2Description: Datasheet; ComponentLink2URL: http://industrial.panasonic.com/cdbs/www-data/pdf/RDA0000/AOA0000C86.pdf; DatasheetVersion: 04/2015; Length: 1 mm; Max Operating Temperature: 155 degC; Min Operating Temperature: -55 degC; Mounting Technology: Surface Mount; Package Quantity: 10000; PackageDescription: 2-Pin Surface Mount Device, Body 1 x 0.5 mm; Packaging: Tape and Reel; PartNumber: ERJ-2RKF1002X; RoHSCompliant: true; Tolerance: 1%; Width: 0.5 mm; Height: 0.35 mm; Mount: Surface Mount; PackageReference: 0402; Pins: 2; Radiation Hardening: No; REACH SVHC: Yes